# Altium schematic sheet 01 TITLEPAGE.SchDoc: Mr. Truman ECE 453 Project
size A
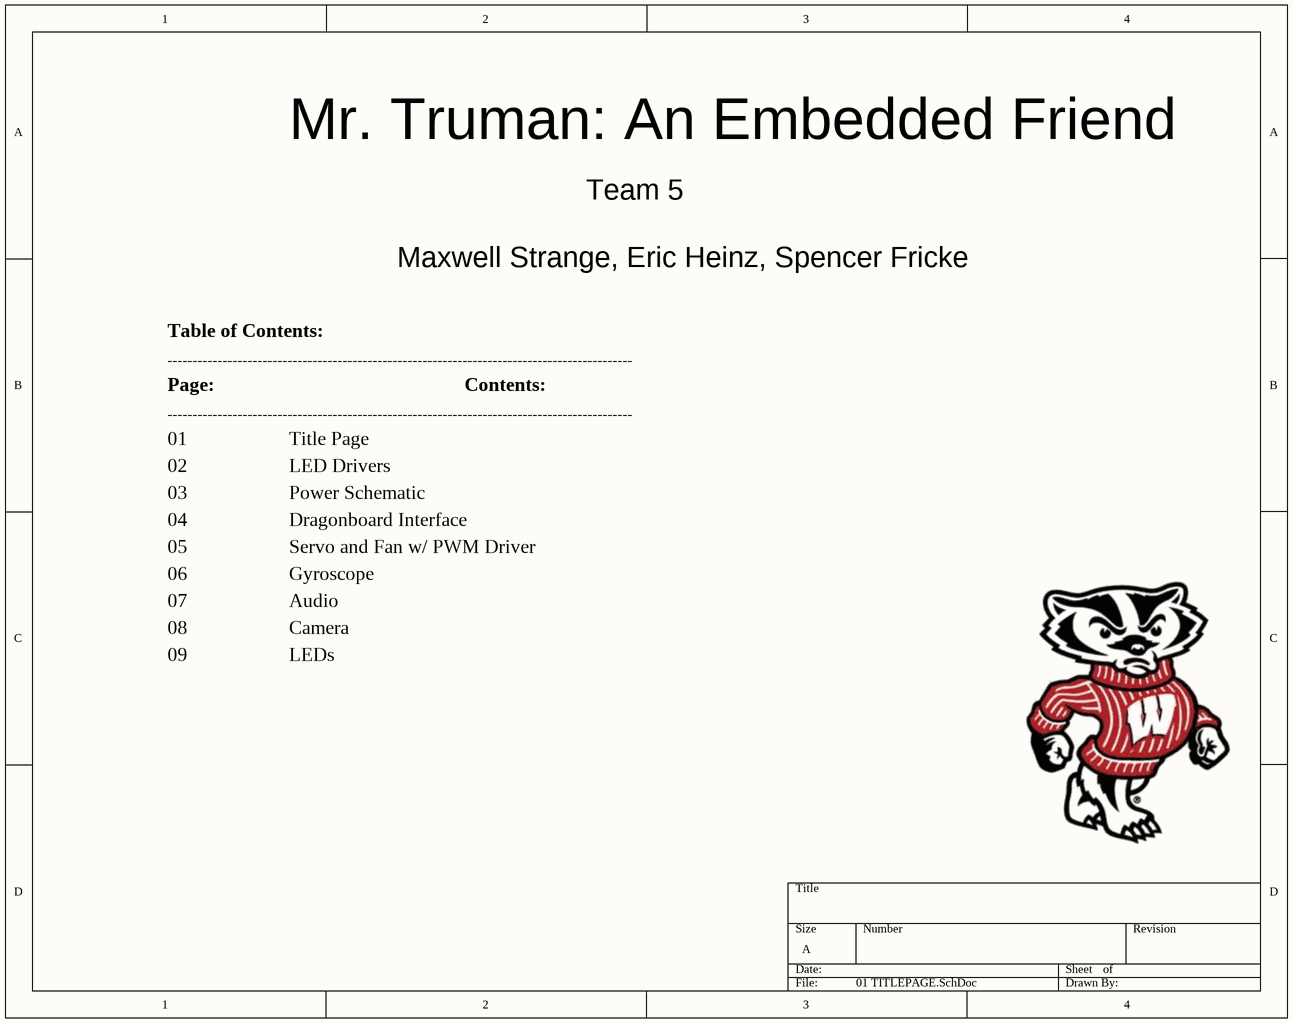
[diagram p0: 01 TITLEPAGE.SchDoc]

## Notes on the sheet
- Mr. Truman: An Embedded Friend
- Team 5
- Maxwell Strange, Eric Heinz, Spencer Fricke
- Table of Contents:
- ---------------------------------------------------------------------------------------------
- Page:
- Contents:
- 01
- 02
- 03
- Title Page
- LED Drivers
- Power Schematic
- 04
- 05
- Dragonboard Interface
- Servo and Fan w/ PWM Driver
- 06
- 07
- 08
- Gyroscope
- Audio
- Camera
- 09
- LEDs